# EAGLE design serial (EAGLE 7.3.0)
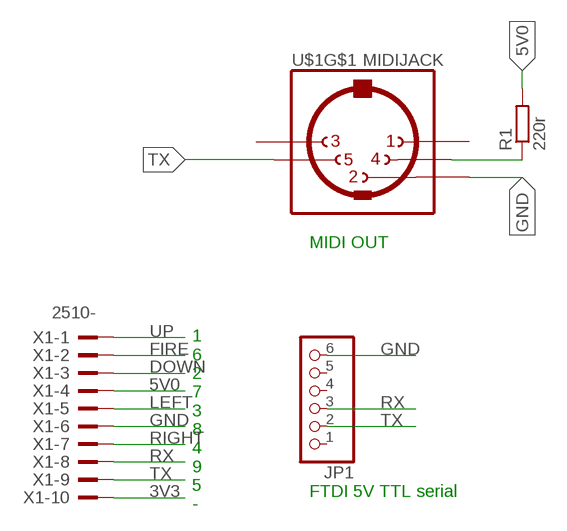
[diagram p0: schematic, sheet 1]

## Parts
JP1  PINHD-1X6CB  [1X06-CLEANBIG]
R1  220r  R-EU_0204/7  [0204/7]
U$1  MIDIJACK  [CP-2350]
X1  2510-  [PAK100/2500-10]

## Nets
3V3: X1.10
5V0: R1.2 X1.4
DOWN: X1.3
FIRE: X1.2
GND: JP1.6 U$1.2 X1.6
LEFT: X1.5
N$5: R1.1 U$1.4
RIGHT: X1.7
RX: JP1.3 X1.8
TX: JP1.2 U$1.5 X1.9
UP: X1.1
Unconnected: JP1.1 JP1.4 JP1.5 U$1.1 U$1.3 U$1.PE1(MT) U$1.PE2(MT) U$1.PE(MT) U$1.PE@(MT)

## Notes on the sheet
- MIDI OUT
- FTDI 5V TTL serial
- 1
  6
  2
  7
  3
  8
  4
  9
  5
  -

## Library data of the parts
JP1 = adafruit:PINHD-1X6: PIN HEADER
R1 = rcl:R-EU_: RESISTOR, European symbol
U$1 = adafruit:MIDIJACK: DIN 5 jack also known as MIDI jack A modification of conn-hirshman:MAB5SH with two options for the grounding 'teeth'
X1 = con-3m:2510-: 3M (TM) Pak 100 4-Wall Header Source: 3M; MF: 3M; MPN: 2510-6002UB; OC_FARNELL: 9838244; OC_NEWARK: 46F4725

## Board
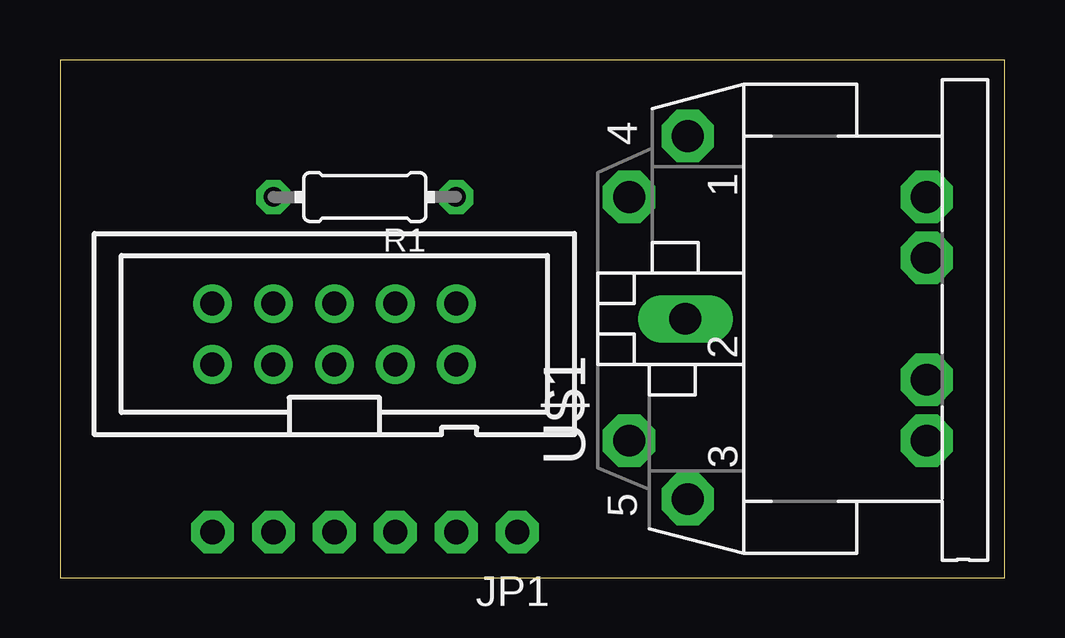
[diagram p1: board, top side]
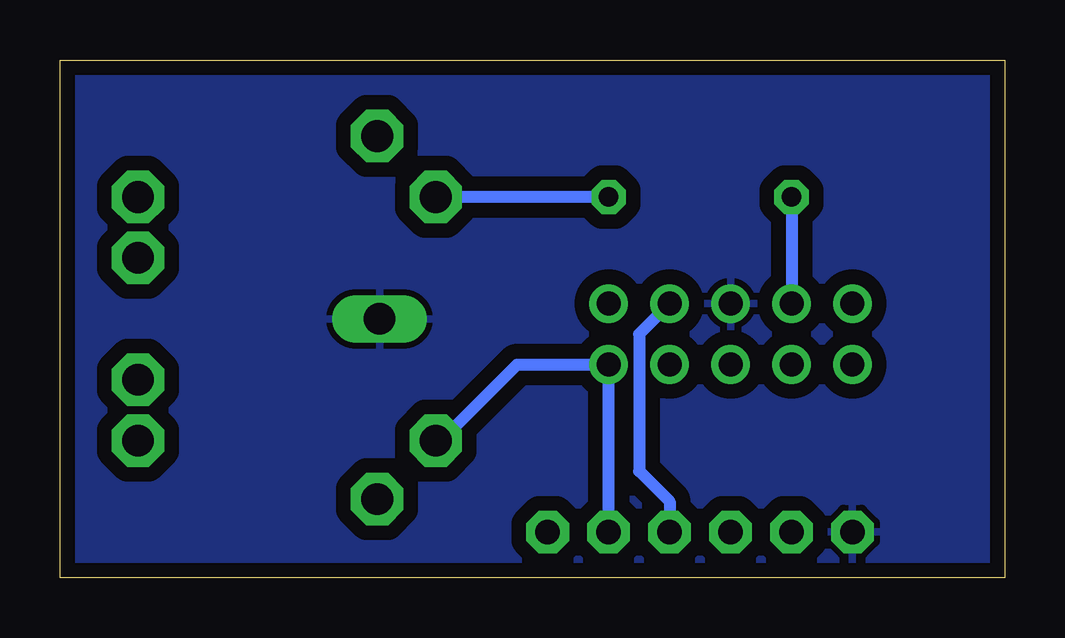
[diagram p2: board, bottom side, seen from below]

Size 39.37 x 21.59 mm. Coordinates in mm from the lower left corner, seen from the top.
Outline: 0,0 39.37,0 39.37,21.59 0,21.59 0,0
Copper layers (1*16): Top 0.035mm / dielectric 1.5mm / Bottom 0.035mm
Design rules "SparkFun": minimum track width 8mil, minimum drill 20mil, track to track 8mil, track to pad 8mil, pad to pad 8mil, via to via 8mil, smd to smd 8mil, copper to edge 10mil, drill to drill 8mil, minimum pad ring 12mil, minimum via ring 10mil, stop-mask expansion 4mil, vias tented up to drill 25mil, thermal gap 10mil

### Footprints (pad centres in the part's own frame; a part is rotated, then mirrored left to right if it is on the bottom)
1X06-CLEANBIG = drill 1.016 pad 1.778 octagon: 1 -6.35,0; 2 -3.81,0; 3 -1.27,0; 4 1.27,0; 5 3.81,0; 6 6.35,0
0204/7 = drill 0.813 octagon: 1 -3.81,0; 2 3.81,0
CP-2350 = drill 1.321 pad 2.184 octagon: 1 7.62,12.58; 3 -7.52,12.58; 4 5.08,15.02; 5 -5.08,15.02; PE -2.54,2.62; PE1 -5.08,2.62; PE2 5.08,2.62; PE@ 2.54,2.62 | drill 1.321 long: 2 0,12.68
PAK100/2500-10 = drill 1 pad 1.422: 1 -5.08,-1.27; 2 -5.08,1.27; 3 -2.54,-1.27; 4 -2.54,1.27; 5 0,-1.27; 6 0,1.27; 7 2.54,-1.27; 8 2.54,1.27; 9 5.08,-1.27; 10 5.08,1.27

### Placement (x,y rotation side)
JP1  12.7,1.91 180 top
R1  12.7,15.88 180 top
U$1  38.73,10.8 90 top
X1  11.43,10.16 0 top

### Tracks (layer width: path | path; a pad name or v marks a point on that pad's centre or on a via)
5V0
  Bottom 0.508: R1.2 X1.4
GND
  pour Bottom (isolate 0.61): 0,21.59 39.37,21.59 39.37,0 0,0
N$5
  Bottom 0.508: R1.1 U$1.4
RX
  Bottom 0.508: X1.8 15.24,10.16 15.24,4.45 13.97,3.18 JP1.3
TX
  Bottom 0.508: U$1.5 23.49,5.71 20.32,8.89 X1.9 JP1.2